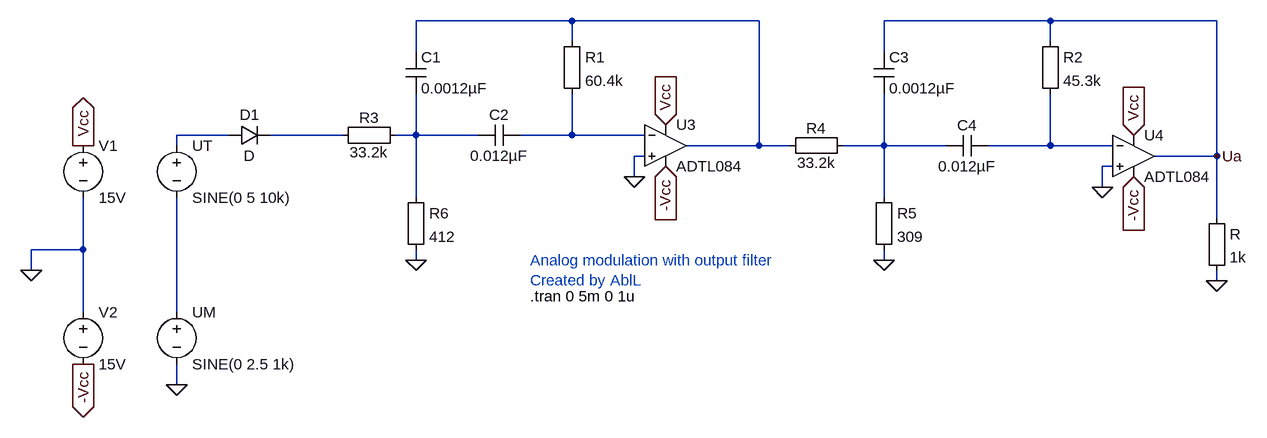
[diagram p0: schematic Analoge-Modulation_mit_Filter.asc]
Analoge-Modulation_mit_Filter.asc, the LTspice schematic file:
Version 4
SHEET 1 1764 680
WIRE 656 -208 416 -208
WIRE 944 -208 656 -208
WIRE 1392 -208 1136 -208
WIRE 1648 -208 1392 -208
WIRE 656 -176 656 -208
WIRE 1392 -176 1392 -208
WIRE 416 -160 416 -208
WIRE 1136 -160 1136 -208
WIRE 128 -32 48 -32
WIRE 304 -32 192 -32
WIRE 416 -32 416 -96
WIRE 416 -32 384 -32
WIRE 512 -32 416 -32
WIRE 656 -32 656 -96
WIRE 656 -32 576 -32
WIRE 768 -32 656 -32
WIRE 48 -16 48 -32
WIRE 944 -16 944 -208
WIRE 944 -16 832 -16
WIRE 992 -16 944 -16
WIRE 1136 -16 1136 -96
WIRE 1136 -16 1072 -16
WIRE 1232 -16 1136 -16
WIRE 1392 -16 1392 -96
WIRE 1392 -16 1296 -16
WIRE 1488 -16 1392 -16
WIRE 768 0 752 0
WIRE 1648 0 1648 -208
WIRE 1648 0 1552 0
WIRE 1488 16 1472 16
WIRE 752 32 752 0
WIRE 1472 48 1472 16
WIRE 416 64 416 -32
WIRE 1136 64 1136 -16
WIRE 1648 96 1648 0
WIRE -96 144 -96 64
WIRE -96 144 -176 144
WIRE 416 160 416 144
WIRE 1136 160 1136 144
WIRE -176 176 -176 144
WIRE 1648 192 1648 176
WIRE -96 240 -96 144
WIRE 48 240 48 64
WIRE 48 352 48 320
FLAG 48 352 0
FLAG 416 160 0
FLAG 1136 160 0
FLAG 752 32 0
FLAG 1472 48 0
FLAG -176 176 0
FLAG -96 -16 Vcc
IOPIN -96 -16 Out
FLAG -96 320 -Vcc
IOPIN -96 320 Out
FLAG 800 -48 Vcc
IOPIN 800 -48 In
FLAG 1520 -32 Vcc
IOPIN 1520 -32 In
FLAG 1520 32 -Vcc
IOPIN 1520 32 In
FLAG 800 16 -Vcc
IOPIN 800 16 In
FLAG 1648 192 0
FLAG 1648 0 Ua
SYMBOL Misc\\EuropeanResistor 1632 80 R0
SYMATTR InstName R
SYMATTR Value 1k
SYMBOL voltage 48 -32 R0
WINDOW 123 0 0 Left 0
WINDOW 39 0 0 Left 0
SYMATTR InstName UT
SYMATTR Value SINE(0 5 10k)
SYMBOL voltage 48 224 R0
WINDOW 123 0 0 Left 0
WINDOW 39 0 0 Left 0
SYMATTR InstName UM
SYMATTR Value SINE(0 2.5 1k)
SYMBOL diode 128 -16 R270
WINDOW 0 32 32 VTop 2
WINDOW 3 0 32 VBottom 2
SYMATTR InstName D1
SYMBOL Misc\\EuropeanResistor 640 -192 R0
SYMATTR InstName R1
SYMATTR Value 60.4k
SYMBOL Misc\\EuropeanResistor 1376 -192 R0
SYMATTR InstName R2
SYMATTR Value 45.3k
SYMBOL Misc\\EuropeanResistor 400 -48 R90
WINDOW 0 5 56 VBottom 2
WINDOW 3 27 56 VTop 2
SYMATTR InstName R3
SYMATTR Value 33.2k
SYMBOL cap 400 -160 R0
SYMATTR InstName C1
SYMATTR Value 0.0012µF
SYMBOL cap 576 -48 R90
WINDOW 0 0 32 VBottom 2
WINDOW 3 32 32 VTop 2
SYMATTR InstName C2
SYMATTR Value 0.012µF
SYMBOL cap 1120 -160 R0
SYMATTR InstName C3
SYMATTR Value 0.0012µF
SYMBOL cap 1296 -32 R90
WINDOW 0 0 32 VBottom 2
WINDOW 3 32 32 VTop 2
SYMATTR InstName C4
SYMATTR Value 0.012µF
SYMBOL Misc\\EuropeanResistor 1088 -32 R90
WINDOW 0 5 56 VBottom 2
WINDOW 3 27 56 VTop 2
SYMATTR InstName R4
SYMATTR Value 33.2k
SYMBOL Opamps\\ADTL084 800 -80 R0
SYMATTR InstName U3
SYMBOL Opamps\\ADTL084 1520 -64 R0
SYMATTR InstName U4
SYMBOL Misc\\EuropeanResistor 1120 48 R0
SYMATTR InstName R5
SYMATTR Value 309
SYMBOL Misc\\EuropeanResistor 400 48 R0
SYMATTR InstName R6
SYMATTR Value 412
SYMBOL voltage -96 -32 R0
WINDOW 123 0 0 Left 0
WINDOW 39 0 0 Left 0
SYMATTR InstName V1
SYMATTR Value 15V
SYMBOL voltage -96 224 R0
WINDOW 123 0 0 Left 0
WINDOW 39 0 0 Left 0
SYMATTR InstName V2
SYMATTR Value 15V
TEXT 592 216 Left 2 !.tran 0 5m 0 1u
TEXT 592 160 Left 2 ;Analog modulation with output filter\nCreated by AblL

The netlist it stands for:
* Analoge-Modulation_mit_Filter.asc
R Ua 0 1k
V§UT N002 N008 SINE(0 5 10k)
V§UM N008 0 SINE(0 2.5 1k)
D1 N002 N003 D
R1 N001 N005 60.4k
R2 Ua N007 45.3k
R3 N004 N003 33.2k
C1 N001 N004 0.0012µF
C2 N005 N004 0.012µF
C3 Ua N006 0.0012µF
C4 N007 N006 0.012µF
R4 N006 N001 33.2k
XU3 0 N005 Vcc -Vcc N001 ADTL084  ; pins In+ In- V+ V- OUT
XU4 0 N007 Vcc -Vcc Ua ADTL084  ; pins In+ In- V+ V- OUT
R5 N006 0 309
R6 N004 0 412
V1 Vcc 0 15V
V2 0 -Vcc 15V
.model D D
.lib standard.dio
.tran 0 5m 0 1u
* Analog modulation with output filter
* Created by AblL
.lib ADTL084.lib
.backanno
.end